# Altium schematic sheet Micro.SchDoc
size A0
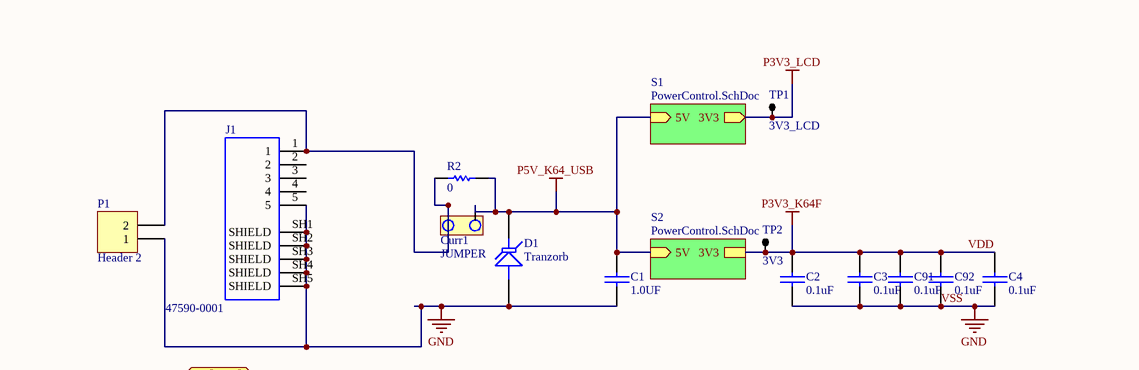
[diagram p0: Micro.SchDoc, top left]
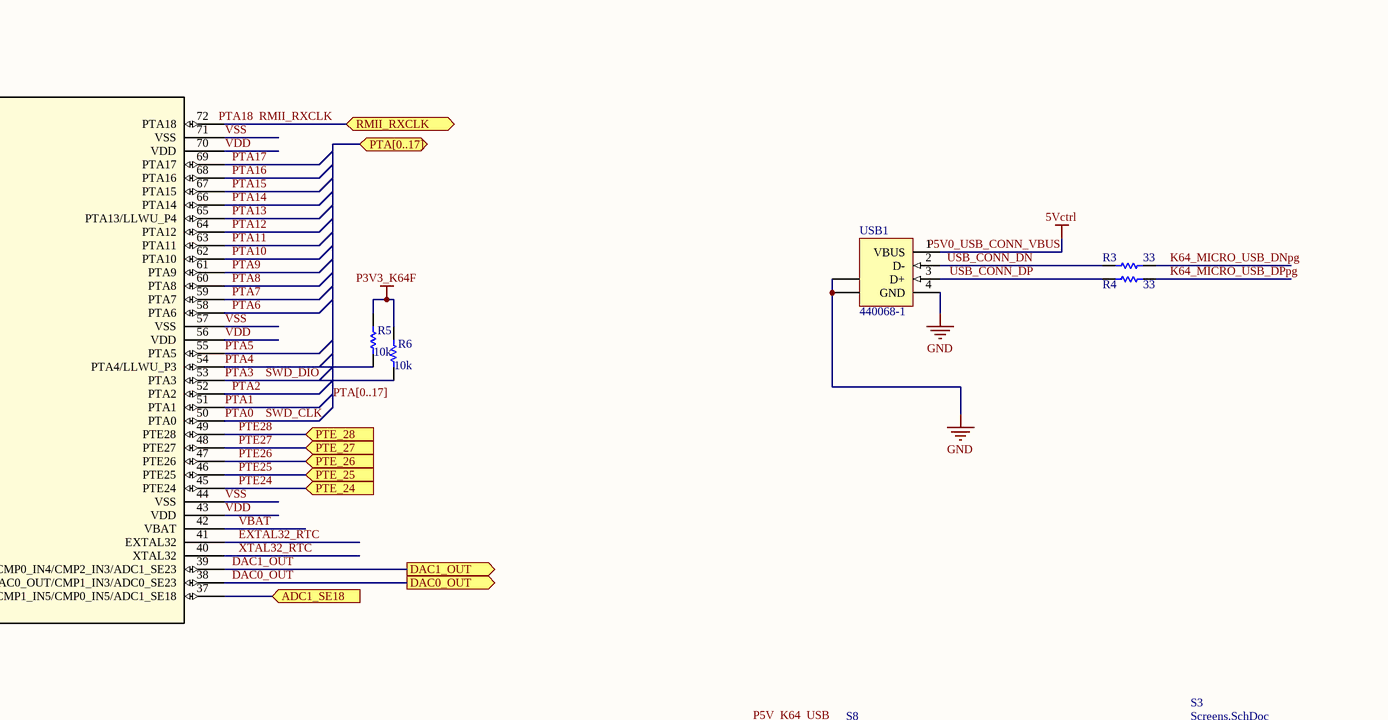
[diagram p1: Micro.SchDoc, top right]
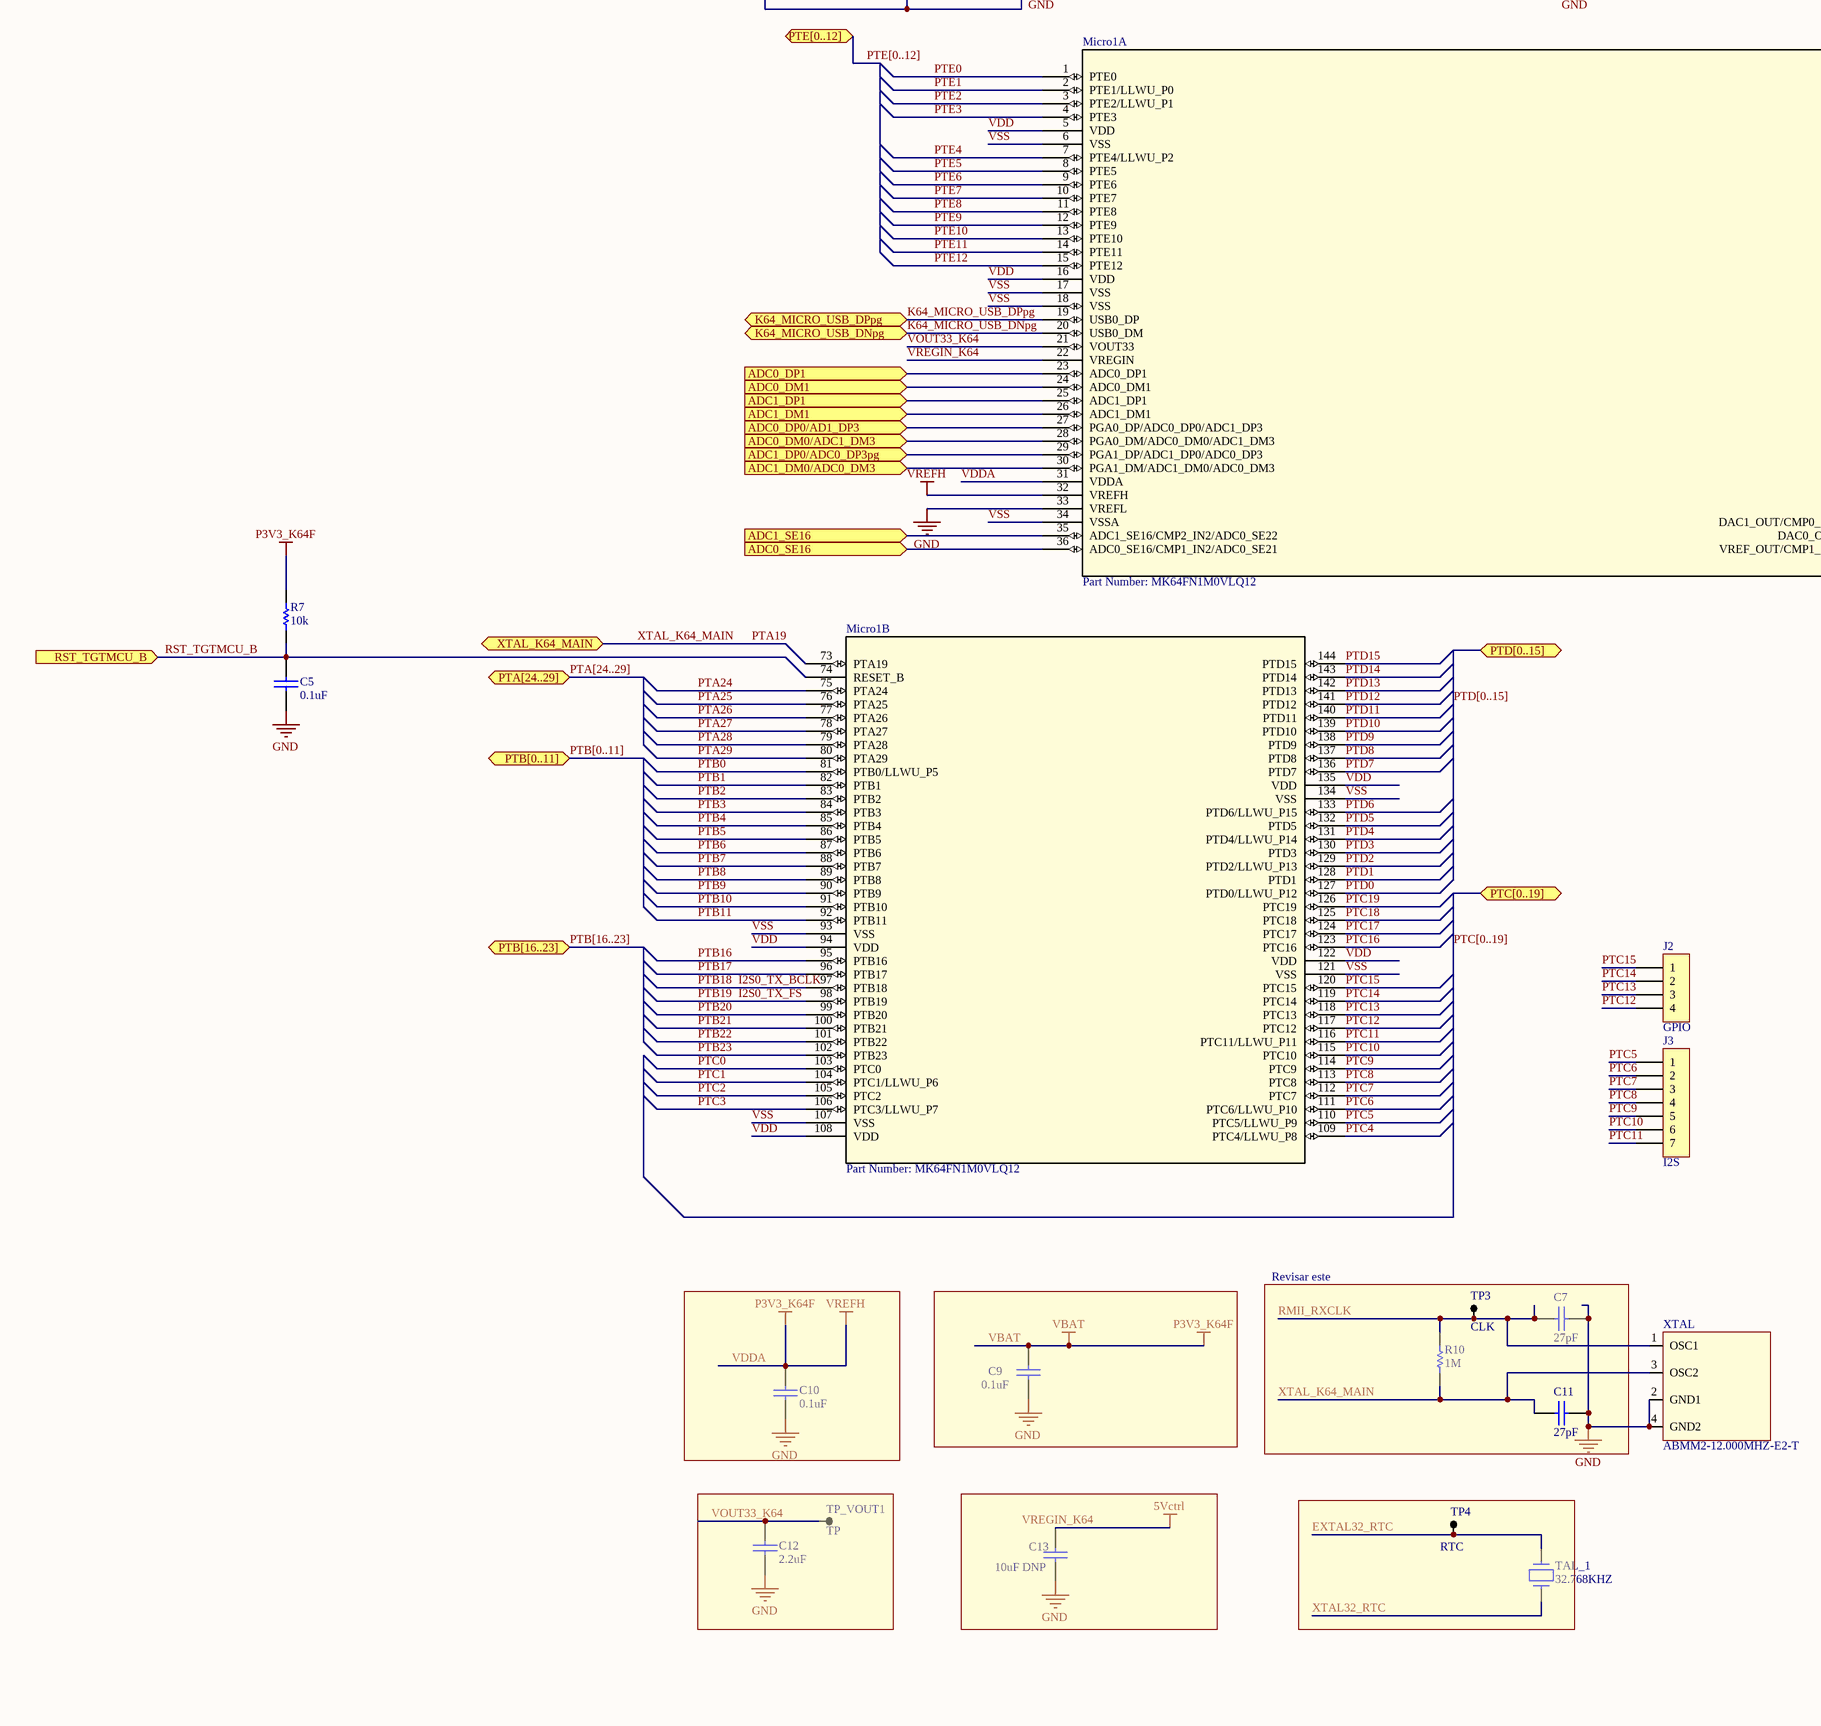
[diagram p2: Micro.SchDoc, bottom left]
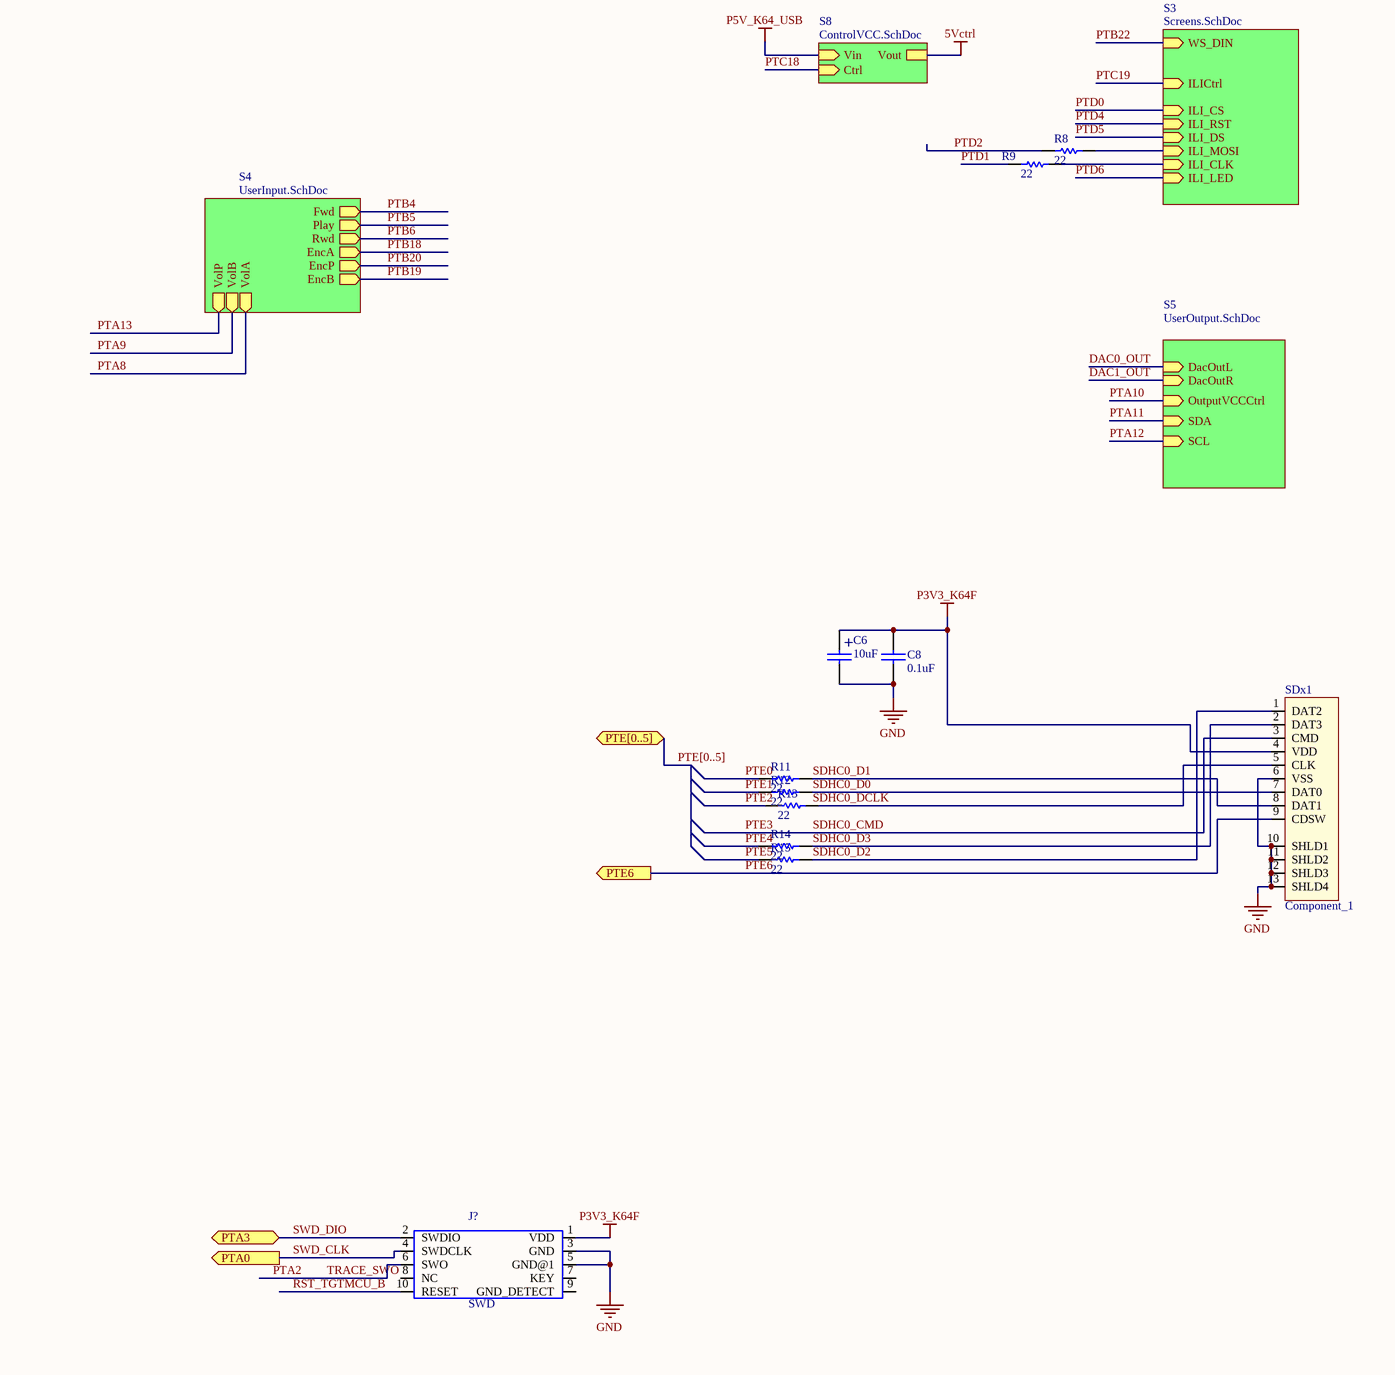
[diagram p3: Micro.SchDoc, bottom right]

## Parts
C1  1.0UF  [0805]
C2  0.1uF  [0805]
C3  0.1uF  [0805]
C4  0.1uF  [0805]
C5  0.1uF  [0805]
C6  10uF  [CAP100RP]
C7  27pF  [0805]
C8  0.1uF  [0805]
C9  0.1uF  [0805]
C10  0.1uF  [0805]
C11  27pF  [0805]
C12  2.2uF  [0805]
C13  10uF DNP  [0805]
C91  0.1uF  [0805]
C92  0.1uF  [0805]
Curr1  JUMPER  [JUMPER2]
D1  Tranzorb  [DO-7]
J1  47590-0001  [*MOLEX_47590-0001_47590-0001(Primary)]
J2  GPIO  [SIP4]
J3  I2S  [SIP7]
J?  SWD  [*2X10_BOXHEADER]
Micro1  Part Number: MK64FN1M0VLQ12  [LQFP-144_20X20X1]  (parts A,B of 2)
P1  Header 2  [HDR1X2]
R2  0  [0805]
R3  33  [0805]
R4  33  [0805]
R5  10k  [0805]
R6  10k  [0805]
R7  10k  [0805]
R8  22  [0805]
R9  22  [0805]
R10  1M  [0805]
R11  22  [0805]
R12  22  [0805]
R13  22  [0805]
R14  22  [0805]
R15  22  [0805]
SDx1  Component_1  [SD]
TAL_1  32.768KHZ  [CRISTAL PERFIL]
TP1  3V3_LCD  [TPTH]
TP2  3V3  [TPTH]
TP3  CLK  [TPTH]
TP4  RTC  [TPTH]
TP_VOUT1  TP  [TPTH]
USB1  440068-1  [440068]
XTAL  ABMM2-12.000MHZ-E2-T  [*OSCCC600X360X120]

## Blocks framed on the sheet
Revisar este: C7 C11 R10 TP3

## Sub-sheets
S1 = PowerControl.SchDoc: 5V (in), 3V3 (out)
S2 = PowerControl.SchDoc: 5V (in), 3V3
S3 = Screens.SchDoc: WS_DIN (in), ILI_CS (in), ILI_RST (in), ILI_DS (in), ILI_MOSI (in), ILI_CLK (in), ILI_LED (in), ILICtrl (in)
S4 = UserInput.SchDoc: Fwd (out), Play (out), Rwd (out), EncA (out), EncP (out), EncB (out), VolP (out), VolB (out), VolA (out)
S5 = UserOutput.SchDoc: DacOutL (in), DacOutR (in), OutputVCCCtrl (in), SDA (in), SCL (in)
S8 = ControlVCC.SchDoc: Vin (in), Vout, Ctrl (in)

## Ports
ADC0_DM0/ADC1_DM3 (in), ADC0_DM1 (in), ADC0_DP0/AD1_DP3 (in), ADC0_DP1 (in), ADC0_SE16 (in), ADC1_DM0/ADC0_DM3 (in), ADC1_DM1 (in), ADC1_DP0/ADC0_DP3pg (in), ADC1_DP1 (in), ADC1_SE16 (in), ADC1_SE18 (in), DAC0_OUT (out), DAC1_OUT (out), K64_MICRO_USB_DNpg (bidir), K64_MICRO_USB_DPpg (bidir), PTA0 (out), PTA3 (bidir), PTA[0..17] (bidir), PTA[24..29] (bidir), PTB[0..11] (bidir), PTB[16..23] (bidir), PTC[0..19] (bidir), PTD[0..15] (bidir), PTE6 (out), PTE[0..5] (bidir), PTE[0..12] (bidir), PTE_24 (in), PTE_25 (in), PTE_26 (in), PTE_27 (in), PTE_28 (in), RMII_RXCLK (bidir), RST_TGTMCU_B (in), XTAL_K64_MAIN (bidir)

## Nets
5Vctrl: C13.1 USB1.1(VBUS) ; sheet S8/Vout
P3V3_LCD: TP1.1 ; sheet S1/3V3
P5V_K64_USB: C1.1 Curr1.2 D1.2(K) R2.2 ; sheet S2/5V, sheet S1/5V, sheet S8/Vin
VBAT: C2.1 C3.1 C4.1 C6.1 C8.1 C9.1 C10.1 C91.1 C92.1 J?.1(VDD) Micro1.5(VDD) Micro1.16(VDD) Micro1.31(VDDA) Micro1.32(VREFH) Micro1.42(VBAT) Micro1.43(VDD) Micro1.56(VDD) Micro1.70(VDD) Micro1.94(VDD) Micro1.108(VDD) Micro1.122(VDD) Micro1.135(VDD) R5.2 R6.2 R7.1 SDx1.4(VDD) TP2.1 ; sheet S2/3V3  [also labelled P3V3_K64F, VDD, VDDA, VREFH]
VSS: C1.2 C2.2 C3.2 C4.2 C5.2 C6.2 C7.2 C8.2 C9.2 C10.2 C11.2 C12.2 C13.2 C91.2 C92.2 D1.1(A) J1.5 J1.SH1(SHIELD) J1.SH2(SHIELD) J1.SH3(SHIELD) J1.SH4(SHIELD) J1.SH5(SHIELD) J?.3(GND) J?.5(GND@1) Micro1.6(VSS) Micro1.17(VSS) Micro1.18(VSS) Micro1.33(VREFL) Micro1.34(VSSA) Micro1.44(VSS) Micro1.57(VSS) Micro1.71(VSS) Micro1.93(VSS) Micro1.107(VSS) Micro1.121(VSS) Micro1.134(VSS) P1.1 SDx1.6(VSS) SDx1.10(SHLD1) SDx1.11(SHLD2) SDx1.12(SHLD3) SDx1.13(SHLD4) USB1.4(GND) USB1.5(SHLD) USB1.6(SHLD) XTAL.2(GND1) XTAL.4(GND2)  [also labelled GND]
ADC0_DM0/ADC1_DM3: Micro1.28(PGA0_DM/ADC0_DM0/ADC1_DM3) ; port ADC0_DM0/ADC1_DM3
ADC0_DM1: Micro1.24(ADC0_DM1) ; port ADC0_DM1
ADC0_DP0/AD1_DP3: Micro1.27(PGA0_DP/ADC0_DP0/ADC1_DP3) ; port ADC0_DP0/AD1_DP3
ADC0_DP1: Micro1.23(ADC0_DP1) ; port ADC0_DP1
ADC0_SE16: Micro1.36(ADC0_SE16/CMP1_IN2/ADC0_SE21) ; port ADC0_SE16
ADC1_DM0/ADC0_DM3: Micro1.30(PGA1_DM/ADC1_DM0/ADC0_DM3) ; port ADC1_DM0/ADC0_DM3
ADC1_DM1: Micro1.26(ADC1_DM1) ; port ADC1_DM1
ADC1_DP0/ADC0_DP3pg: Micro1.29(PGA1_DP/ADC1_DP0/ADC0_DP3) ; port ADC1_DP0/ADC0_DP3pg
ADC1_DP1: Micro1.25(ADC1_DP1) ; port ADC1_DP1
ADC1_SE16: Micro1.35(ADC1_SE16/CMP2_IN2/ADC0_SE22) ; port ADC1_SE16
ADC1_SE18: Micro1.37(VREF_OUT/CMP1_IN5/CMP0_IN5/ADC1_SE18) ; port ADC1_SE18
DAC0_OUT: Micro1.38(DAC0_OUT/CMP1_IN3/ADC0_SE23) ; port DAC0_OUT, sheet S5/DacOutL
DAC1_OUT: Micro1.39(DAC1_OUT/CMP0_IN4/CMP2_IN3/ADC1_SE23) ; port DAC1_OUT, sheet S5/DacOutR
EXTAL32_RTC: Micro1.41(EXTAL32) TAL_1.2 TP4.1
I2S0_TX_BCLK: Micro1.97(PTB18) ; sheet S4/EncA  [also labelled PTB18]
I2S0_TX_FS: Micro1.98(PTB19) ; sheet S4/EncB  [also labelled PTB19]
K64_MICRO_USB_DNpg: Micro1.20(USB0_DM) R3.1 ; port K64_MICRO_USB_DNpg
K64_MICRO_USB_DPpg: Micro1.19(USB0_DP) R4.1 ; port K64_MICRO_USB_DPpg
PTA0: J?.4(SWDCLK) Micro1.50(PTA0) ; port PTA0  [also labelled SWD_CLK]
PTA1: Micro1.51(PTA1)
PTA2: J?.6(SWO) Micro1.52(PTA2)  [also labelled TRACE_SWO]
PTA3: J?.2(SWDIO) Micro1.53(PTA3) R6.1 ; port PTA3  [also labelled SWD_DIO]
PTA4: Micro1.54(PTA4/LLWU_P3) R5.1
PTA5: Micro1.55(PTA5)
PTA6: Micro1.58(PTA6)
PTA7: Micro1.59(PTA7)
PTA8: Micro1.60(PTA8) ; sheet S4/VolA
PTA9: Micro1.61(PTA9) ; sheet S4/VolB
PTA10: Micro1.62(PTA10) ; sheet S5/OutputVCCCtrl
PTA11: Micro1.63(PTA11) ; sheet S5/SDA
PTA12: Micro1.64(PTA12) ; sheet S5/SCL
PTA13: Micro1.65(PTA13/LLWU_P4) ; sheet S4/VolP
PTA14: Micro1.66(PTA14)
PTA15: Micro1.67(PTA15)
PTA16: Micro1.68(PTA16)
PTA17: Micro1.69(PTA17)
PTA19: C11.1 Micro1.73(PTA19) R10.1 XTAL.3(OSC2) ; port XTAL_K64_MAIN  [also labelled XTAL_K64_MAIN]
PTA24: Micro1.75(PTA24)
PTA25: Micro1.76(PTA25)
PTA26: Micro1.77(PTA26)
PTA27: Micro1.78(PTA27)
PTA28: Micro1.79(PTA28)
PTA29: Micro1.80(PTA29)
PTB0: Micro1.81(PTB0/LLWU_P5)
PTB1: Micro1.82(PTB1)
PTB2: Micro1.83(PTB2)
PTB3: Micro1.84(PTB3)
PTB4: Micro1.85(PTB4) ; sheet S4/Fwd
PTB5: Micro1.86(PTB5) ; sheet S4/Play
PTB6: Micro1.87(PTB6) ; sheet S4/Rwd
PTB7: Micro1.88(PTB7)
PTB8: Micro1.89(PTB8)
PTB9: Micro1.90(PTB9)
PTB10: Micro1.91(PTB10)
PTB11: Micro1.92(PTB11)
PTB16: Micro1.95(PTB16)
PTB17: Micro1.96(PTB17)
PTB20: Micro1.99(PTB20) ; sheet S4/EncP
PTB21: Micro1.100(PTB21)
PTB22: Micro1.101(PTB22) ; sheet S3/WS_DIN
PTB23: Micro1.102(PTB23)
PTC0: Micro1.103(PTC0)
PTC1: Micro1.104(PTC1/LLWU_P6)
PTC2: Micro1.105(PTC2)
PTC3: Micro1.106(PTC3/LLWU_P7)
PTC4: Micro1.109(PTC4/LLWU_P8)
PTC5: J3.1 Micro1.110(PTC5/LLWU_P9)
PTC6: J3.2 Micro1.111(PTC6/LLWU_P10)
PTC7: J3.3 Micro1.112(PTC7)
PTC8: J3.4 Micro1.113(PTC8)
PTC9: J3.5 Micro1.114(PTC9)
PTC10: J3.6 Micro1.115(PTC10)
PTC11: J3.7 Micro1.116(PTC11/LLWU_P11)
PTC12: J2.4 Micro1.117(PTC12)
PTC13: J2.3 Micro1.118(PTC13)
PTC14: J2.2 Micro1.119(PTC14)
PTC15: J2.1 Micro1.120(PTC15)
PTC16: Micro1.123(PTC16)
PTC17: Micro1.124(PTC17)
PTC18: Micro1.125(PTC18) ; sheet S8/Ctrl
PTC19: Micro1.126(PTC19) ; sheet S3/ILICtrl
PTD0: Micro1.127(PTD0/LLWU_P12) ; sheet S3/ILI_CS
PTD1: Micro1.128(PTD1) R9.2
PTD2: Micro1.129(PTD2/LLWU_P13) R8.2
PTD3: Micro1.130(PTD3)
PTD4: Micro1.131(PTD4/LLWU_P14) ; sheet S3/ILI_RST
PTD5: Micro1.132(PTD5) ; sheet S3/ILI_DS
PTD6: Micro1.133(PTD6/LLWU_P15) ; sheet S3/ILI_LED
PTD7: Micro1.136(PTD7)
PTD8: Micro1.137(PTD8)
PTD9: Micro1.138(PTD9)
PTD10: Micro1.139(PTD10)
PTD11: Micro1.140(PTD11)
PTD12: Micro1.141(PTD12)
PTD13: Micro1.142(PTD13)
PTD14: Micro1.143(PTD14)
PTD15: Micro1.144(PTD15)
PTE0: Micro1.1(PTE0) R11.2
PTE1: Micro1.2(PTE1/LLWU_P0) R12.2
PTE2: Micro1.3(PTE2/LLWU_P1) R13.2
PTE3: Micro1.4(PTE3) SDx1.3(CMD)  [also labelled SDHC0_CMD]
PTE4: Micro1.7(PTE4/LLWU_P2) R14.2
PTE5: Micro1.8(PTE5) R15.2
PTE6: Micro1.9(PTE6) SDx1.9(CDSW) ; port PTE6
PTE7: Micro1.10(PTE7)
PTE8: Micro1.11(PTE8)
PTE9: Micro1.12(PTE9)
PTE10: Micro1.13(PTE10)
PTE11: Micro1.14(PTE11)
PTE12: Micro1.15(PTE12)
PTE24: Micro1.45(PTE24) ; port PTE_24
PTE25: Micro1.46(PTE25) ; port PTE_25
PTE26: Micro1.47(PTE26) ; port PTE_26
PTE27: Micro1.48(PTE27) ; port PTE_27
PTE28: Micro1.49(PTE28) ; port PTE_28
RMII_RXCLK: C7.1 Micro1.72(PTA18) R10.2 TP3.1 XTAL.1(OSC1) ; port RMII_RXCLK
RST_TGTMCU_B: C5.1 J?.10(RESET) Micro1.74(RESET_B) R7.2 ; port RST_TGTMCU_B
SDHC0_D0: R12.1 SDx1.7(DAT0)
SDHC0_D1: R11.1 SDx1.8(DAT1)
SDHC0_D2: R15.1 SDx1.1(DAT2)
SDHC0_D3: R14.1 SDx1.2(DAT3)
USB_CONN_DN: R3.2 USB1.2(D-)
USB_CONN_DP: R4.2 USB1.3(D+)
VOUT33_K64: C12.1 Micro1.21(VOUT33) TP_VOUT1.1
VREGIN_K64: Micro1.22(VREGIN)
XTAL32_RTC: Micro1.40(XTAL32) TAL_1.1
NetCurr1_1: Curr1.1 J1.1 P1.2 R2.1
NetR8_1: R8.1 ; sheet S3/ILI_MOSI
NetR9_1: R9.1 ; sheet S3/ILI_CLK
NetR13_1: R13.1 SDx1.5(CLK)

Not connected (* = marked no-connect by the designer): J1 2 3 4; J? 7(KEY) 8(NC) 9(GND_DETECT)

## Buses and harness runs
bus PTA[0..17] = port PTA[0..17]
bus PTA[24..29] = port PTA[24..29]
bus PTB[0..11] = port PTB[0..11]
bus PTB[16..23] = port PTB[16..23]
bus PTC[0..19] = port PTC[0..19]
bus PTD[0..15] = port PTD[0..15]
bus PTE[0..5] = port PTE[0..5]
bus PTE[0..12] = port PTE[0..12]

## Notes on the sheet
- Labels drawn without touching a wire or pin: P5V0_USB_CONN_VBUS, PTA18, SDHC0_DCLK, VREGIN_K64
- (in symbol CAPPOL) +

## Library data of the parts
C1-C5 C7-C13 C91 C92 = CAP
C6 = CAPPOL
D1 = Tranzorb: Transient Voltage Suppression (TVS) Diode; Published: 24-Mar-1999; LatestRevisionDate: 17-Jul-2002; LatestRevisionNote: Re-released for DXP Platform.; PackageReference: DO-7; Publisher: Altium Limited; PackageDescription: Axial Lead Diode
J1 = 47590-0001: 0.65mm _.0256_ Pitch Micro-USB AB Receptacle, Right Angle, Bottom Mount, SMT, Lead Free; MF: Molex; Price: None; SnapEDA_Link: https://www.snapeda.com/parts/47590-0001/Molex/view-part/?ref=snap; MP: 47590-0001; Package: None; Availability: Unavailable; Value: *
J2 = CON4
J3 = CON7
J? = SWD: 3M_TM_ ScotchCode_TM_ Wire Marker Write-On Dispenser SWD, Wire O.D. 0.09 to 0.31 Inches; MF: 3M; SnapEDA_Link: https://www.snapeda.com/parts/SWD/3M%20%28TC%29/view-part/?ref=snap; Availability: Unavailable; MP: SWD; Price: None; Package: None; Value: *
Micro1 = MK64FN1M0VLQ12: No Description Available; Vendor: NXP; CPU: ARM Cortex-M4F; Max_Frequency: 120; Flash_KB: 1024; SRAM_KB: 256; Pin_Count: 144; Manufacturer_Part_Number: MK64FN1M0VLQ12; Package: LQFP; Copyright: Copyright (C) 2016 Accelerated Designs. All rights reserved; RefDes: RefDes; Type: DEV; Value: Value
P1 = Header 2: Header, 2-Pin; LatestRevisionDate: 17-Jul-2002; LatestRevisionNote: Re-released for DXP Platform.; Publisher: Altium Limited
R2-R15 = RES
TAL_1 = CRISTAL
TP1-TP4 = TP
USB1 = 440068-1: USB 1.1, Right Angle, Thru-Hole, Reverse Type, Receptacle, 4 Position, Black; ContactMaterial: Copper Alloy; ContactPlating: Gold Flash; TerminationLength: 2.40mm [0.094in.]; PCB_Layout: Complies with manufacturer's recommendation.; DrillSize: Corresponds to nominal value.; PanelGround: Without; Published: 15-Jul-2004; DatasheetDocument: 18-Mar-2004; PackageDocument: 18-Mar-2004; PackageReference: 440068; Publisher: Altium Limited; HousingMaterial: Glass-Filled Thermoplastic; ComponentLink1Description: Manufacturer Link; ComponentLink1URL: http://www.tycoelectronics.com/; ComponentLink2Description: Packaging Specification; ComponentLink2URL: http://ecommas.tycoelectronics.com/commerce/DocumentDelivery/DDEController?Action=showdoc&DocId=Customer+Drawing%7F440068%7FD%7Ftif%7FEnglish%7FC_440068_D.tif
XTAL = Component_1